# Altium schematic sheet H4RG_Preamp.SchDoc
size A3
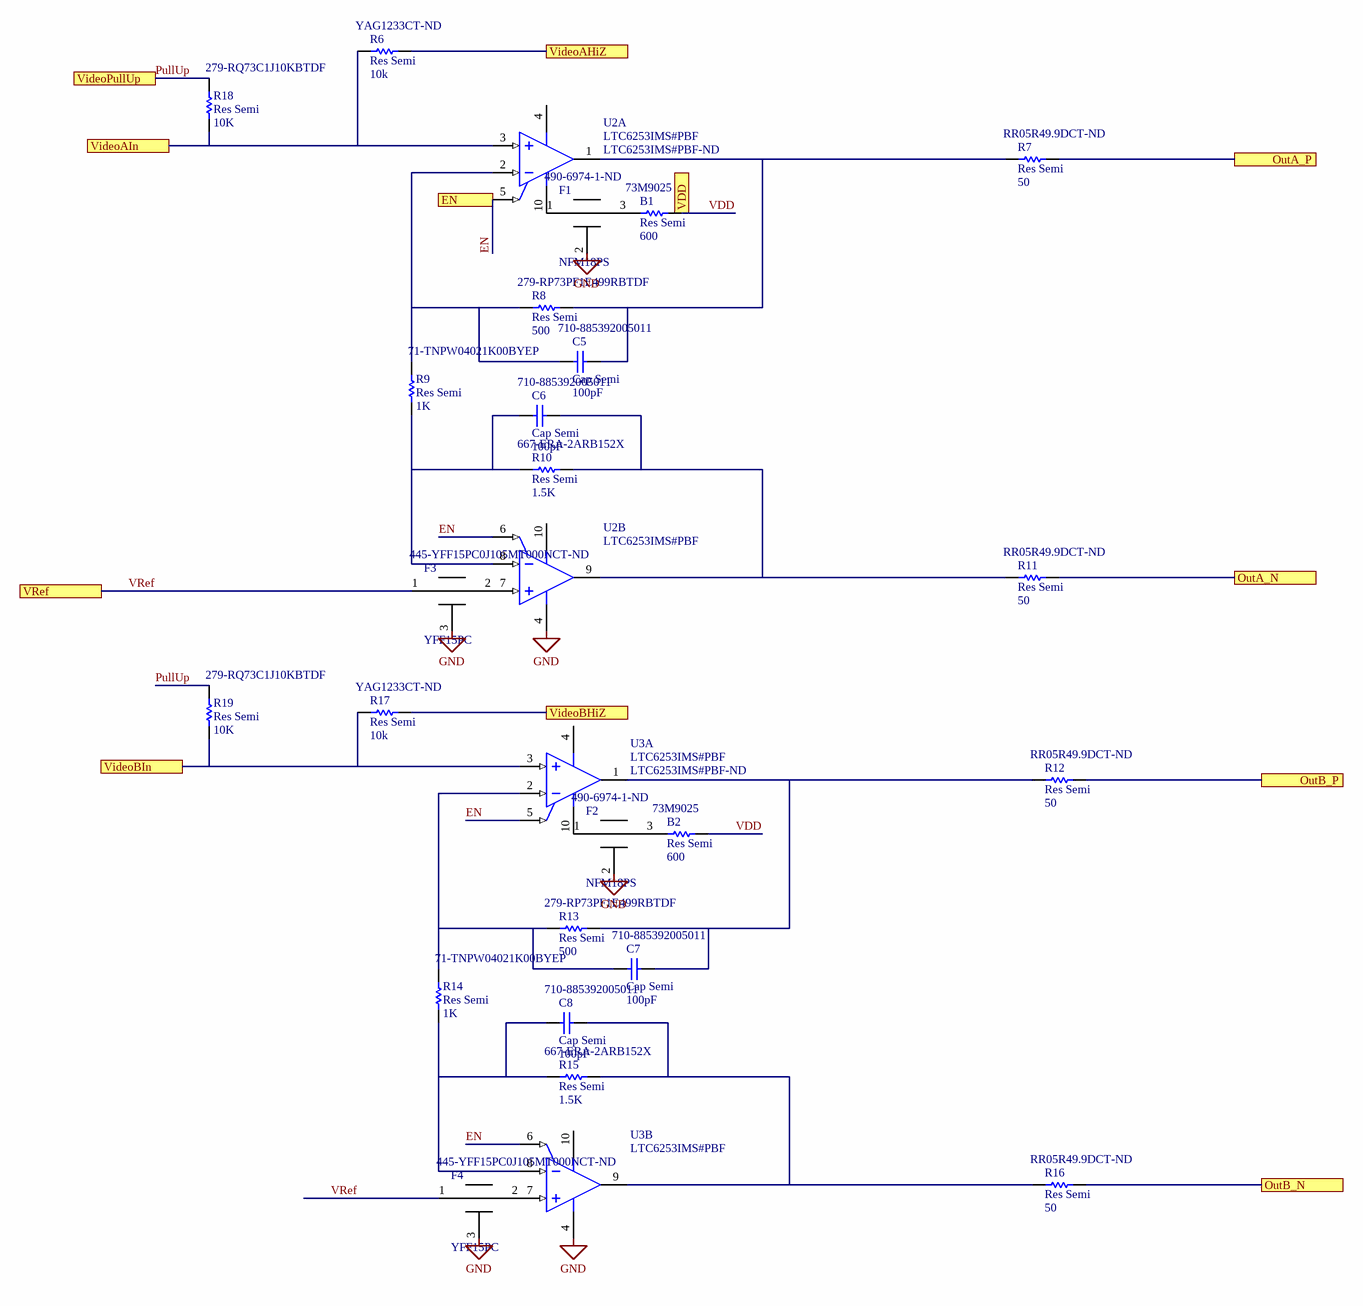
[diagram p0: H4RG_Preamp.SchDoc]

## Parts
B1  Res Semi  value 600  Supplier Part Number 1: 73M9025  [RESC1005X04N]
B2  Res Semi  value 600  Supplier Part Number 1: 73M9025  [RESC1005X04N]
C5  Cap Semi  value 100pF  Supplier Part Number 1: 710-885392005011  [CAPC1005X06L]
C6  Cap Semi  value 100pF  Supplier Part Number 1: 710-885392005011  [CAPC1005X06L]
C7  Cap Semi  value 100pF  Supplier Part Number 1: 710-885392005011  [CAPC1005X06L]
C8  Cap Semi  value 100pF  Supplier Part Number 1: 710-885392005011  [CAPC1005X06L]
F1  NFM18PS  Supplier Part Number 1: 490-6974-1-ND  [NFM18PS_0603]
F2  NFM18PS  Supplier Part Number 1: 490-6974-1-ND  [NFM18PS_0603]
F3  YFF15PC  Supplier Part Number 1: 445-YFF15PC0J105MT000NCT-ND  [YFF15PC]
F4  YFF15PC  Supplier Part Number 1: 445-YFF15PC0J105MT000NCT-ND  [YFF15PC]
R6  Res Semi  value 10k  Supplier Part Number 1: YAG1233CT-ND  [RESC1005X04N]
R7  Res Semi  value 50  Supplier Part Number 1: RR05R49.9DCT-ND  [RESC1005X04N]
R8  Res Semi  value 500  Supplier Part Number 1: 279-RP73PF1E499RBTDF  [RESC1005X04N]
R9  Res Semi  value 1K  Supplier Part Number 1: 71-TNPW04021K00BYEP  [RESC1005X04N]
R10  Res Semi  value 1.5K  Supplier Part Number 1: 667-ERA-2ARB152X  [RESC1005X04N]
R11  Res Semi  value 50  Supplier Part Number 1: RR05R49.9DCT-ND  [RESC1005X04N]
R12  Res Semi  value 50  Supplier Part Number 1: RR05R49.9DCT-ND  [RESC1005X04N]
R13  Res Semi  value 500  Supplier Part Number 1: 279-RP73PF1E499RBTDF  [RESC1005X04N]
R14  Res Semi  value 1K  Supplier Part Number 1: 71-TNPW04021K00BYEP  [RESC1005X04N]
R15  Res Semi  value 1.5K  Supplier Part Number 1: 667-ERA-2ARB152X  [RESC1005X04N]
R16  Res Semi  value 50  Supplier Part Number 1: RR05R49.9DCT-ND  [RESC1005X04N]
R17  Res Semi  value 10k  Supplier Part Number 1: YAG1233CT-ND  [RESC1005X04N]
R18  Res Semi  value 10K  Supplier Part Number 1: 279-RQ73C1J10KBTDF  [Res0603LD]
R19  Res Semi  value 10K  Supplier Part Number 1: 279-RQ73C1J10KBTDF  [Res0603LD]
U2  LTC6253IMS#PBF  Supplier Part Number 1: LTC6253IMS#PBF-ND  [LT-MS-10_N]  (parts A,B of 2)
U3  LTC6253IMS#PBF  Supplier Part Number 1: LTC6253IMS#PBF-ND  [LT-MS-10_N]  (parts A,B of 2)

## Ports
EN, OutA_N, OutA_P, OutB_N, OutB_P, VDD, VideoAHiZ, VideoAIn, VideoBHiZ, VideoBIn, VideoPullUp, VRef

## Nets
GND: F1.2 F2.2 F3.3 F4.3 U2.4(V-) U3.4(V-)
EN: U2.5(~{SHDNA}) U2.6(~{SHDNB}) U3.5(~{SHDNA}) U3.6(~{SHDNB}) ; port EN
OutA_N: R11.2 ; port OutA_N
OutA_P: R7.2 ; port OutA_P
OutB_N: R16.2 ; port OutB_N
OutB_P: R12.2 ; port OutB_P
PullUp: R18.2 R19.2 ; port VideoPullUp
VDD: B1.2 B2.2 ; port VDD
VideoAHiZ: R6.2 ; port VideoAHiZ
VideoAIn: R6.1 R18.1 U2.3(+IN_A) ; port VideoAIn
VideoBHiZ: R17.2 ; port VideoBHiZ
VideoBIn: R17.1 R19.1 U3.3(+IN_A) ; port VideoBIn
VRef: F3.1 F4.1 ; port VRef
NetB1_1: B1.1 F1.3
NetB2_1: B2.1 F2.3
NetC5_1: C5.1 R8.2 R9.2 U2.2(-IN_A)
NetC5_2: C5.2 R7.1 R8.1 U2.1(OUT_A)
NetC6_1: C6.1 R9.1 R10.1 U2.8(-IN_B)
NetC6_2: C6.2 R10.2 R11.1 U2.9(OUT_B)
NetC7_1: C7.1 R13.2 R14.2 U3.2(-IN_A)
NetC7_2: C7.2 R12.1 R13.1 U3.1(OUT_A)
NetC8_1: C8.1 R14.1 R15.1 U3.8(-IN_B)
NetC8_2: C8.2 R15.2 R16.1 U3.9(OUT_B)
NetF1_1: F1.1 U2.10(V+)
NetF2_1: F2.1 U3.10(V+)
NetF3_2: F3.2 U2.7(+IN_B)
NetF4_2: F4.2 U3.7(+IN_B)

## Library data of the parts
B1 B2 = Res Semi: FERRITE BEAD 600 OHM 0402 1LN; Manufacturer 1: Murata; Manufacturer Part Number 1: BLM15AG601SN1D; Frequency: 100MHz; Impedance: 600R; Tolerance: 25%; Current Rating: 300mA; DC Resistance (DCR): 520mR; Number of Lines: 1; Shielding: Unshielded; DC Resistance-Max: 600mR; Published: 8-Jun-2000; LatestRevisionDate: 17-Jul-2002; LatestRevisionNote: Re-released for DXP Platform.; PackageReference: AXIAL-0.5; Publisher: Altium Limited; PackageDescription: Axial Device, Thru-Hole; 2 Leads; 0.5 in Pin Spacing; Supplier 1: Newark; RoHS: Yes; Category: Inductors; Stock 1: 22552; Pricing 1: 1=0.10000, 10=0.06300, 25=0.05300, 50=0.04400, 100=0.03400 (USD); Case/Package: 0402; Number of Pins: 2; Core Material: Ferrite; Case Code (Metric): 1005; Case Code (Imperial): 0402; Material: Steel,Ferrite; Min Operating Temperature: -55°C; Max Operating Temperature: 125°C; Package Quantity: 10000; Packaging: Tape and Reel; Series: BLM15AG_SN; Max Current Rating: 300mA; Max DC Current: 300mA; Termination: SMD/SMT; Test Frequency: 100MHz; DC Current: 300mA; Number of Circuits: 1; Length: 1mm; Width: 0.5mm; Height: 0.5mm; Depth: 0.55mm; Radiation Hardening: No; RoHS Compliant: Yes; Lead Free: Lead Free; REACH SVHC: No SVHC; Military Standard: Not; ComponentLink1URL: https://datasheet.ciiva.com/11799/0900766b811b5866-11799226.pdf?src-supplier=RSComponents; ComponentLink1Description: https://datasheet.ciiva.com/11799/0900766b811b5866-11799226.pdf?src-supplier=RSComponents; ComponentLink2URL: https://datasheet.ciiva.com/29347/442210-da-01-en-chip-drossel-0402-600r-300ma-1-0x0-5mm-29347879.pdf?src-supplier=Conrad; ComponentLink2Description: https://datasheet.ciiva.com/29347/442210-da-01-en-chip-drossel-0402-600r-300ma-1-0x0-5mm-29347879.pdf?src-supplier=Conrad; ComponentLink3URL: https://datasheet.ciiva.com/41449/001172163-da-01-en-drossel-0402-600r-1-0x0-5mm-10000st-41449450.pdf?src-supplier=Conrad; ComponentLink3Description: https://datasheet.ciiva.com/41449/001172163-da-01-en-drossel-0402-600r-1-0x0-5mm-10000st-41449450.pdf?src-supplier=Conrad; ComponentLink4URL: https://datasheet.ciiva.com/6212/l0110s0100blm15ag-sn-6212565.pdf?src-supplier=Digi-Key; ComponentLink4Description: https://datasheet.ciiva.com/6212/l0110s0100blm15ag-sn-6212565.pdf?src-supplier=Digi-Key; ComponentLink5URL: https://datasheet.ciiva.com/6212/l0110s0100blm15ag-sn-6212520.pdf?src-supplier=Digi-Key; ComponentLink5Description: https://datasheet.ciiva.com/6212/l0110s0100blm15ag-sn-6212520.pdf?src-supplier=Digi-Key; ComponentLink6URL: https://datasheet.ciiva.com/8510/l0110s0100blm15ag-sn-8510909.pdf?src-supplier=Avnet; ComponentLink6Description: https://datasheet.ciiva.com/8510/l0110s0100blm15ag-sn-8510909.pdf?src-supplier=Avnet; ComponentLink7URL: https://datasheet.ciiva.com/14122/blm-series-eng-tds-14122894.pdf?src-supplier=Distrelec; ComponentLink7Description: https://datasheet.ciiva.com/14122/blm-series-eng-tds-14122894.pdf?src-supplier=Distrelec; ComponentLink8URL: https://datasheet.ciiva.com/8084/l0110s0100blm15ag-sn-8084271.pdf?src-supplier=Avnet; ComponentLink8Description: https://datasheet.ciiva.com/8084/l0110s0100blm15ag-sn-8084271.pdf?src-supplier=Avnet; ComponentLink9URL: https://datasheet.ciiva.com/6212/l0110s0100blm15ag-sn-6212519.pdf?src-supplier=Digi-Key; ComponentLink9Description: https://datasheet.ciiva.com/6212/l0110s0100blm15ag-sn-6212519.pdf?src-supplier=Digi-Key; ComponentLink10URL: https://datasheet.ciiva.com/1466/5144-1466744.pdf?src-supplier=Element14; ComponentLink10Description: https://datasheet.ciiva.com/1466/5144-1466744.pdf?src-supplier=Element14; ComponentLink11URL: https://datasheet.ciiva.com/1466/5144-1466745.pdf?src-supplier=Element14; ComponentLink11Description: https://datasheet.ciiva.com/1466/5144-1466745.pdf?src-supplier=Element14
C5-C8 = Cap Semi: Cap, 3.3Pf, 50V, Rf Mlcc, 0402; Manufacturer 1: Wurth Electronics; Manufacturer Part Number 1: 885392005011; Published: 8-Jun-2000; LatestRevisionDate: 29-May-2009; LatestRevisionNote: IPC-7351 Footprint Added.; PackageReference: C1206; Publisher: Altium Limited; PackageDescription: Chip Capacitor; Supplier 1: Mouser; RoHS: No; Category: Ceramic Capacitors; Stock 1: 8631; Pricing 1: 1=0.10000, 10=0.05700, 50=0.05300, 100=0.04700, 1000=0.04200, 10000=0.03800 (USD)
F1 F2 = NFM18PS: CAP FEEDTHRU 1UF 20% 6.3V 0603; Manufacturer 1: Murata; Manufacturer Part Number 1: NFM18PS105R0J3D; Max Current Rating: 2A; DC Resistance (DCR): 30mR; Insulation Resistance: 500MR; Supplier 1: Digi-Key; RoHS: Yes; Category: EMI / RFI Components; Stock 1: 137999; Pricing 1: 1=0.15000, 10=0.13800, 25=0.13160, 50=0.12760, 100=0.12320, 250=0.11688, 500=0.09776, 1000=0.07586 (USD); Mount: Surface Mount,PCB; Case/Package: 0603; Case Code (Metric): 1608; Case Code (Imperial): 0603; Weight: 7.1E-05oz; Min Operating Temperature: -55°C; Max Operating Temperature: 105°C; Package Quantity: 1; Capacitance: 1uF; Packaging: Tape and Reel; Tolerance: 20%; Max Voltage Rating (DC): 6.3V; Voltage Rating (DC): 6.3V; Current Rating: 2A; Voltage Rating: 6.3V; Voltage: 6.3V; Current: 2A; Termination: Flat; Length: 1.6mm; Width: 0.8mm; Height: 0.6mm; Depth: 0.8mm; Radiation Hardening: No; REACH SVHC: No SVHC; Lead Free: Lead Free; RoHS Compliant: Yes; ComponentLink1URL: https://datasheet.ciiva.com/18093/getdatasheetpartid-224466-18093204.pdf?src-supplier=Verical; ComponentLink1Description: https://datasheet.ciiva.com/18093/getdatasheetpartid-224466-18093204.pdf?src-supplier=Verical; ComponentLink2URL: https://datasheet.ciiva.com/14187/nfm18ps-series-eng-tds-14187253.pdf?src-supplier=Distrelec; ComponentLink2Description: https://datasheet.ciiva.com/14187/nfm18ps-series-eng-tds-14187253.pdf?src-supplier=Distrelec; ComponentLink3URL: https://datasheet.ciiva.com/11795/0900766b80a00710-11795483.pdf?src-supplier=RSComponents; ComponentLink3Description: https://datasheet.ciiva.com/11795/0900766b80a00710-11795483.pdf?src-supplier=RSComponents; ComponentLink4URL: https://datasheet.ciiva.com/26341/647520-da-01-en-smd-emi-filter-nfm18ps105r0j3d-2000st-26341288.pdf?src-supplier=Conrad; ComponentLink4Description: https://datasheet.ciiva.com/26341/647520-da-01-en-smd-emi-filter-nfm18ps105r0j3d-2000st-26341288.pdf?src-supplier=Conrad; ComponentLink5URL: https://datasheet.ciiva.com/16631/l0111s0111nfm18ps-16631061.pdf?src-supplier=Avnet+Europe; ComponentLink5Description: https://datasheet.ciiva.com/16631/l0111s0111nfm18ps-16631061.pdf?src-supplier=Avnet+Europe; ComponentLink6URL: https://datasheet.ciiva.com/3068/l0111s0111nfm18ps-3068153.pdf?src-supplier=Avnet; ComponentLink6Description: https://datasheet.ciiva.com/3068/l0111s0111nfm18ps-3068153.pdf?src-supplier=Avnet; ComponentLink7URL: https://datasheet.ciiva.com/6211/l0111s0111nfm18ps-6211069.pdf?src-supplier=Digi-Key; ComponentLink7Description: https://datasheet.ciiva.com/6211/l0111s0111nfm18ps-6211069.pdf?src-supplier=Digi-Key; ComponentLink8URL: https://datasheet.ciiva.com/6213/l0111s0111nfm18ps-6213519.pdf?src-supplier=Digi-Key; ComponentLink8Description: https://datasheet.ciiva.com/6213/l0111s0111nfm18ps-6213519.pdf?src-supplier=Digi-Key; ComponentLink9URL: https://datasheet.ciiva.com/16469/l0111s0111nfm18ps-16469023.pdf?src-supplier=Future+Electronics; ComponentLink9Description: https://datasheet.ciiva.com/16469/l0111s0111nfm18ps-16469023.pdf?src-supplier=Future+Electronics
F3 F4 = YFF15PC: Feedthrough Capacitor, 1UF, 4V, 0402;; Manufacturer 1: TDK; Manufacturer Part Number 1: YFF15PC0J105MT000N; Supplier 1: Digi-Key
R6 R17 = Res Semi: Resistor;Resistance:10Kohm;Resistance Tolerance:± 1%;Resistor Element Material:Thin Film;Resistor Case Style:0402; Manufacturer 1: Yageo; Manufacturer Part Number 1: RT0402FRE0710KL; Resistance: 10kR; Temperature Coefficient: 50ppm/°C; Power Rating: 62.5mW; Voltage Rating: 50V; Max Power Dissipation: 63mW; Published: 8-Jun-2000; LatestRevisionDate: 17-Jul-2002; LatestRevisionNote: Re-released for DXP Platform.; PackageReference: AXIAL-0.5; Publisher: Altium Limited; PackageDescription: Axial Device, Thru-Hole; 2 Leads; 0.5 in Pin Spacing; Supplier 1: Digi-Key; RoHS: Yes; Category: Chip SMD Resistors; Stock 1: 38150; Pricing 1: 1=0.10000, 10=0.07000, 100=0.02830, 1000=0.01272, 2500=0.01104, 5000=0.00912 (USD); Case/Package: 0402; Contact Plating: Tin,Matte,Lead; Case Code (Metric): 1005; Case Code (Imperial): 0402; Weight: 2.3E-05oz; Size Code: 0402; Min Operating Temperature: -55°C; Max Operating Temperature: 125°C; Tolerance: 1%; Resistor Type: Thin Film; Packaging: Tape and Reel; Package Quantity: 10000; Number of Terminations: 2; Termination: SMD/SMT; Voltage Rating (DC): 50V; Series: RT; Construction: Rectangular; Length: 1mm; Width: 0.02inch; Height: 0.014inch; Depth: 0.5mm; Radiation Hardening: No; Military Standard: Not; Lead Free: Lead Free; RoHS Compliant: Yes; ComponentLink1URL: https://datasheet.ciiva.com/29717/pyu-rt-1-to-0-05-rohs-l-4-29717405.pdf?src-supplier=Digi-Key; ComponentLink1Description: https://datasheet.ciiva.com/29717/pyu-rt-1-to-0-05-rohs-l-4-29717405.pdf?src-supplier=Digi-Key; ComponentLink2URL: https://datasheet.ciiva.com/12836/pyu-rt-1-to-0-05-rohs-l-4-12836638.pdf?src-supplier=Mouser; ComponentLink2Description: https://datasheet.ciiva.com/12836/pyu-rt-1-to-0-05-rohs-l-4-12836638.pdf?src-supplier=Mouser; ComponentLink3URL: https://datasheet.ciiva.com/25647/pyu-rt-1-to-0-05-rohs-l-4-25647211.pdf?src-supplier=Digi-Key; ComponentLink3Description: https://datasheet.ciiva.com/25647/pyu-rt-1-to-0-05-rohs-l-4-25647211.pdf?src-supplier=Digi-Key; ComponentLink4URL: https://datasheet.ciiva.com/8891/pyu-rt-1-to-0-05-rohs-l-4-8891421.pdf?src-supplier=Avnet; ComponentLink4Description: https://datasheet.ciiva.com/8891/pyu-rt-1-to-0-05-rohs-l-4-8891421.pdf?src-supplier=Avnet; ComponentLink5URL: https://datasheet.ciiva.com/29717/pyu-rt-1-to-0-05-rohs-l-4-29717406.pdf?src-supplier=Digi-Key; ComponentLink5Description: https://datasheet.ciiva.com/29717/pyu-rt-1-to-0-05-rohs-l-4-29717406.pdf?src-supplier=Digi-Key
R7 R11 R12 R16 = Res Semi: SUSUMU - RR0510R-49R9-D - RES, THIN FILM, 49R9, 0.5%, 0.0625W, 0402; Voltage Rating (DC): 25V; Resistance: 49.9R; Power Rating: 62.5mW; Temperature Coefficient: 100ppm/°C; Max Power Dissipation: 63mW; Published: 8-Jun-2000; LatestRevisionDate: 17-Jul-2002; LatestRevisionNote: Re-released for DXP Platform.; PackageReference: AXIAL-0.5; Publisher: Altium Limited; PackageDescription: Axial Device, Thru-Hole; 2 Leads; 0.5 in Pin Spacing; Supplier 1: Digi-Key; Manufacturer 1: Susumu; Manufacturer Part Number 1: RR0510R-49R9-D; RoHS: Yes; Category: Chip SMD Resistors; Stock 1: 300149; Pricing 1: 1=0.10000, 10=0.07200, 100=0.02910, 1000=0.01309, 2500=0.01136, 5000=0.00939 (USD); Case/Package: 0402; Number of Pins: 2; Case Code (Imperial): 0402; Case Code (Metric): 1005; Size Code: 0402; Min Operating Temperature: -55°C; Max Operating Temperature: 125°C; Tolerance: 0.5%; Packaging: Tape and Reel; Voltage Rating: 25V; Termination: SMD/SMT; Resistor Type: Thin Film; Series: RR; Number of Terminations: 2; Resistance Tolerance: 0.5%; Length: 1mm; Width: 0.5mm; Height: 0.35mm; Lead Free: Lead Free; REACH SVHC: Unknown; RoHS Compliant: Yes; ComponentLink1URL: https://datasheet.ciiva.com/7984/1581132-7984319.pdf?src-supplier=Element14; ComponentLink1Description: https://datasheet.ciiva.com/7984/1581132-7984319.pdf?src-supplier=Element14
R8 R13 = Res Semi: Res Thin Film 0402 499 Ohm 0.1% 0.1W(1/10W) ±25ppm/C Pad SMD T/R; Manufacturer 1: TE Connectivity; Manufacturer Part Number 1: RP73PF1E499RBTDF; Published: 8-Jun-2000; LatestRevisionDate: 17-Jul-2002; LatestRevisionNote: Re-released for DXP Platform.; PackageReference: AXIAL-0.5; Publisher: Altium Limited; PackageDescription: Axial Device, Thru-Hole; 2 Leads; 0.5 in Pin Spacing; Supplier 1: Mouser; RoHS: Yes; Category: Chip SMD Resistors; Stock 1: 1493; Pricing 1: 1=0.42000, 10=0.30800, 50=0.30800, 100=0.17900, 1000=0.11300, 10000=0.09800 (USD); ComponentLink1URL: http://www.farnell.com/datasheets/2599880.pdf?src-supplier=Farnell; ComponentLink1Description: http://www.farnell.com/datasheets/2599880.pdf?src-supplier=Farnell
R9 R14 = Res Semi: Res Thin Film 0402 1K Ohm 0.1% 0.1W(1/10W) ±10ppm/C Sulfur Resistant Conformal Coated Pad SMD Automotive Medical T/R; Manufacturer 1: Vishay Dale; Manufacturer Part Number 1: TNPW04021K00BYEP; Resistance: 1kR; Max Power Dissipation: 100mW; Temperature Coefficient: 10ppm/°C; Published: 8-Jun-2000; LatestRevisionDate: 17-Jul-2002; LatestRevisionNote: Re-released for DXP Platform.; PackageReference: AXIAL-0.5; Publisher: Altium Limited; PackageDescription: Axial Device, Thru-Hole; 2 Leads; 0.5 in Pin Spacing; Supplier 1: Mouser; RoHS: Yes; Stock 1: 1381; Pricing 1: 1=0.76000, 10=0.66000, 50=0.66000, 100=0.46000, 1000=0.31800, 10000=0.27900 (USD); Case/Package: 0402; Case Code (Imperial): 0402; Case Code (Metric): 1005; Min Operating Temperature: -55°C; Max Operating Temperature: 155°C; Resistor Type: Thin Film; Features: Moisture Resistant,Automotive AEC-Q200,Anti-Sulfur; Packaging: Tape and Reel; Tolerance: 0.1%; Number of Terminations: 2; RoHS Compliant: Yes; ComponentLink1URL: http://www.vishay.com/docs/28758/tnpw_e3.pdf?src-supplier=Digi-Key; ComponentLink1Description: http://www.vishay.com/docs/28758/tnpw_e3.pdf?src-supplier=Digi-Key; ComponentLink2URL: http://www.vishay.com/docs/49252/_dbr_smd_resistor_product_overview_vmn_sg2189_1705.pdf?src-supplier=Digi-Key; ComponentLink2Description: http://www.vishay.com/docs/49252/_dbr_smd_resistor_product_overview_vmn_sg2189_1705.pdf?src-supplier=Digi-Key
R10 R15 = Res Semi: RES SMD 1.5K OHM 0.1% 1/16W 0402; Manufacturer 1: Panasonic; Manufacturer Part Number 1: ERA-2ARB152X; Resistance: 1.5kR; Max Power Dissipation: 63mW; Temperature Coefficient: 10ppm/°C; Voltage Rating (DC): 25V; Published: 8-Jun-2000; LatestRevisionDate: 17-Jul-2002; LatestRevisionNote: Re-released for DXP Platform.; PackageReference: AXIAL-0.5; Publisher: Altium Limited; PackageDescription: Axial Device, Thru-Hole; 2 Leads; 0.5 in Pin Spacing; Supplier 1: Mouser; RoHS: No; Category: Chip SMD Resistors; Stock 1: 9763; Pricing 1: 1=0.77000, 10=0.66700, 50=0.66700, 100=0.46600, 1000=0.28000, 10000=0.25400 (USD); Mount: Surface Mount; Case/Package: 0402; Case Code (Imperial): 0402; Case Code (Metric): 1005; Min Operating Temperature: -55°C; Max Operating Temperature: 155°C; Resistor Type: Thin Film; Number of Terminations: 2; Features: Automotive AEC-Q200; Power Rating: 63mW; Tolerance: 0.1%; Voltage Rating: 25V; Packaging: Cut Tape; Length: 0.039inch; Width: 0.02inch; Height: 0.016inch; Lead Free: Lead Free; REACH SVHC: No SVHC; ComponentLink1URL: http://www.farnell.com/datasheets/2059650.pdf?src-supplier=Farnell; ComponentLink1Description: http://www.farnell.com/datasheets/2059650.pdf?src-supplier=Farnell; ComponentLink2URL: https://media.digikey.com/pdf/Data%20Sheets/Panasonic%20Resistors%20Thermistors%20PDFs/ERA_Series_LE.pdf?src-supplier=Digi-Key; ComponentLink2Description: https://media.digikey.com/pdf/Data%20Sheets/Panasonic%20Resistors%20Thermistors%20PDFs/ERA_Series_LE.pdf?src-supplier=Digi-Key; ComponentLink3URL: http://www.farnell.com/datasheets/1678789.pdf?src-supplier=Element14; ComponentLink3Description: http://www.farnell.com/datasheets/1678789.pdf?src-supplier=Element14; ComponentLink4URL: https://industrial.panasonic.com/cdbs/www-data/pdf/RDM0000/AOA0000C307.pdf?src-supplier=Digi-Key; ComponentLink4Description: https://industrial.panasonic.com/cdbs/www-data/pdf/RDM0000/AOA0000C307.pdf?src-supplier=Digi-Key
R18 R19 = Res Semi: Res SMD 10K Ohm 0.01% 0.15W 0603; Manufacturer 1: TE Connectivity Holsworthy; Manufacturer Part Number 1: RQ73C1J10KBTDF; Max Power Dissipation: 150mW; Temperature Coefficient: 2ppm/°C; Resistance: 10kR; Published: 8-Jun-2000; LatestRevisionDate: 17-Jul-2002; LatestRevisionNote: Re-released for DXP Platform.; PackageReference: AXIAL-0.5; Publisher: Altium Limited; PackageDescription: Axial Device, Thru-Hole; 2 Leads; 0.5 in Pin Spacing; RoHS: Yes; Category: Chip SMD Resistors; Stock 1: 1124; Pricing 1: 1=0.78000, 10=0.59300, 50=0.59300, 100=0.53300, 1000=0.39200, 10000=0.35900 (USD); Case/Package: 0603; Case Code (Imperial): 0603; Case Code (Metric): 1608; Min Operating Temperature: -55°C; Max Operating Temperature: 125°C; Features: Moisture Resistant; Tolerance: 0.01%; Packaging: Tape and Reel; Resistor Type: Thin Film; Number of Terminations: 2; Length: 0.064inch; Width: 0.032inch; Height: 0.02inch; ComponentLink1URL: http://www.vishay.com/docs/60131/pltu.pdf?src-supplier=Digi-Key; ComponentLink1Description: http://www.vishay.com/docs/60131/pltu.pdf?src-supplier=Digi-Key; Supplier 1: Mouser
U2 U3 = CMP-0359-00342-2: Dual Channel, Power Efficient Operational Amplifier, RRIO, 720 MHz Typical GBW, 280 V/us Typical SR, 2.5 to 5.25 V, 10-Pin SOP (MS-10), Industrial, Pb-Free; Manufacturer: Linear Technology; GBW (MHz) Typical: 720; SR (V/us) Typical: 280; Channels (#): 2; Is (mA) Typical: 3.3; Vs Min (V): 2.5; Vos (mV) Typical: 0.05; Vs Max (V): 5.25; RoHS: Pb-Free; Linear Technology Part Number: LTC6253; PackageDescription: 10-Lead Plastic MSOP, Body 3 x 3 mm, Pitch 0.5 mm; ComponentLink1Description: Manufacturer URL; ComponentLink1URL: http://www.linear.com/; PackageVersion: Rev E; Type: VFB; ComponentLink3Description: Package Specification; ComponentLink2URL: http://cds.linear.com/docs/en/datasheet/625234fc.pdf; ComponentLink2Description: Datasheet; Mounting Technology: Surface Mount; DatasheetVersion: Rev. C; PartNumber: LTC6253IMS#PBF; ComponentLink3URL: http://cds.linear.com/docs/en/packaging/MSOP_10_05-08-1661.pdf; RevisionNote: URLs updated; PackageReference: LT-MS-10; Supplier 1: Digi-Key